# Altium schematic sheet MBP-Wireless-Upgrade.SchDoc
size Letter
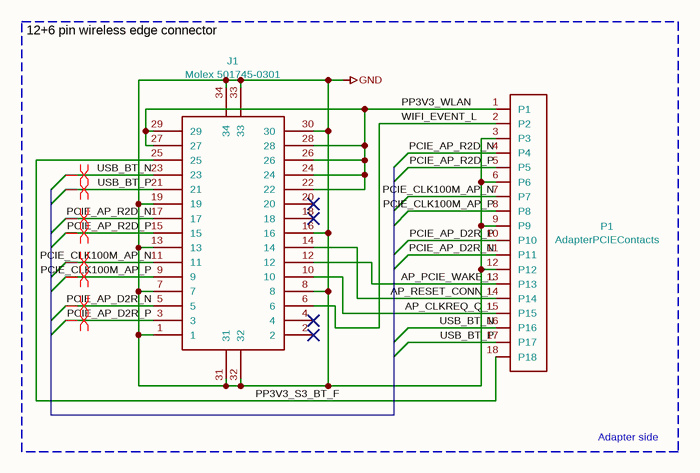
[diagram p0: MBP-Wireless-Upgrade.SchDoc]

## Parts
J1  Molex 501745-0301  [5017450301]
P1  AdapterPCIEContacts  [Edge Connector]

## Blocks framed on the sheet
12+6 pin wireless edge connector: J1 P1

## Nets
GND: J1.1 J1.7 J1.8 J1.13 J1.16 J1.19 J1.30 J1.31 J1.32 J1.33 J1.34 P1.3(P3) P1.6(P6) P1.9(P9) P1.12(P12)
AP_CLKREQ_Q_L: J1.10 P1.15(P15)
AP_PCIE_WAKE_L: J1.12 P1.13(P13)
AP_RESET_CONN_L: J1.14 P1.14(P14)
PCIE_AP_D2R_N: J1.5 P1.11(P11)
PCIE_AP_D2R_P: J1.3 P1.10(P10)
PCIE_AP_R2D_N: J1.17 P1.4(P4)
PCIE_AP_R2D_P: J1.15 P1.5(P5)
PCIE_CLK100M_AP_N: J1.11 P1.7(P7)
PCIE_CLK100M_AP_P: J1.9 P1.8(P8)
PP3V3_S3_BT_F: J1.25 P1.18(P18)
PP3V3_WLAN: J1.22 J1.24 J1.26 J1.27 J1.28 J1.29 P1.1(P1)
USB_BT_N: J1.23 P1.16(P16)
USB_BT_P: J1.21 P1.17(P17)
WIFI_EVENT_L: J1.6 P1.2(P2)

Not connected (* = marked no-connect by the designer): J1 2* 4* 18* 20*

## Layout directives
differential pair: PCIE_AP_D2R_N, PCIE_AP_D2R_P, PCIE_AP_R2D_N, PCIE_AP_R2D_P, PCIE_CLK100M_AP_N, PCIE_CLK100M_AP_P, USB_BT_N, USB_BT_P

## Notes on the sheet
- Adapter side
- Drawn by:
- Krutav.com
- The Krutav Shah Company
- SIZE:
- SHEET:
- US-Letter
- This document and its contents are the property of The Krutav Shah Company. The posessor of this document agrees to the following:
- Proprietary Property Notice:
- 1. Do not distrubte without authorization.
- 3. Use for the purposes of evaluation only.
- 2. Not to reproduce or copy the contents of.
- 4. The Krutav Shah Company reserves all rights.
- Revision:
- Inventory #:

## Library data of the parts
J1 = 501745-0301: Height: 1.64; Mouser Part Number: 538-501745-0301; Mouser Price/Stock: https://www.mouser.com/Search/Refine.aspx?Keyword=538-501745-0301; Manufacturer_Name: Molex; Manufacturer_Part_Number: 501745-0301; Value: Molex 501745-0301
P1 = AdapterPCIEContacts: Value: AdapterPCIEContacts; Footprint: MBPWirelessUpgrade:Edge Connector